# EAGLE schematic lonley rd front plate (EAGLE 8.5.2)
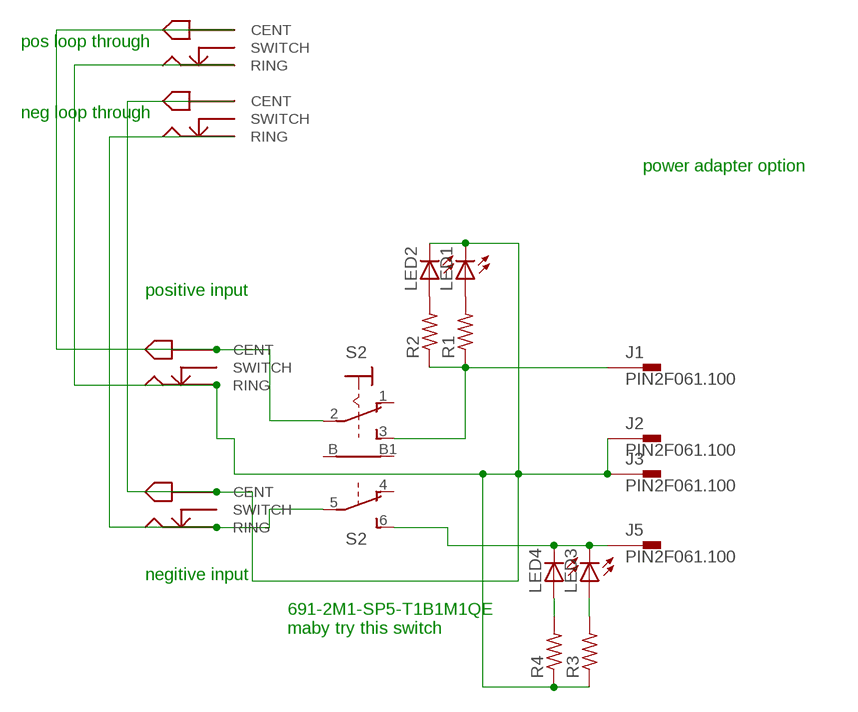
[diagram p0: schematic, sheet 1]

## Parts
J1  PIN2F061.100  [F061.100]
J2  PIN2F061.100  [F061.100]
J3  PIN2F061.100  [F061.100]
J5  PIN2F061.100  [F061.100]
LED1  LED3MM  [LED3MM]
LED2  LED3MM  [LED3MM]
LED3  LED3MM  [LED3MM]
LED4  LED3MM  [LED3MM]
R1  R-US_0309/V  [0309V]
R2  R-US_0309/V  [0309V]
R3  R-US_0309/V  [0309V]
R4  R-US_0309/V  [0309V]
S2  9070-2W  [9070-2W]
U$1  PJ-066A_DC_JACK  [PJ-066A_DC_JACK]
U$2  PJ-066A_DC_JACK  [PJ-066A_DC_JACK]
U$3  PJ-066A_DC_JACK  [PJ-066A_DC_JACK]
U$4  PJ-066A_DC_JACK  [PJ-066A_DC_JACK]

## Nets
N$1: LED2.A R2.2
N$2: J2.A1 J2.A2 J3.A1 J3.A2 LED1.K(C) LED2.K(C) R3.1 R4.1 U$1.RING U$2.CENT U$3.RING U$4.CENT
N$3: J1.A1 J1.A2 R1.1 R2.1 S2.3(1:S)
N$4: J5.A1 J5.A2 LED3.K(C) LED4.K(C)
N$5: S2.2(1:P) U$1.CENT U$3.CENT
N$6: U$2.RING U$4.RING
N$7: LED1.A R1.2
N$10: LED3.A R3.2
N$11: LED4.A R4.2
Unconnected: S2.1(1:O) S2.4(B:O) S2.5(B:P) S2.6(B:S) S2.B1(1:B1) S2.B(1:B) U$1.SWITCH U$2.SWITCH U$3.SWITCH U$4.SWITCH

## Notes on the sheet
- pos loop through
- neg loop through
- power adapter option
- positive input
- negitive input
- 691-2M1-SP5-T1B1M1QE
  maby try this switch

## Library data of the parts
J1-J3 J5 = con-faston:PIN2: Flachstecker Typ Tyco/Electronics/AMP TAB, FASTON Printed Circuit Board Tabs Source: http://www.buerklin.com, http://catalog.tycoelectronics.com; OC_FARNELL: unknown; OC_NEWARK: unknown
LED1-LED4 = adafruit:LED: LED OSRAM: - CHIPLED LG R971, LG N971, LY N971, LG Q971, LY Q971, LO R971, LY R971 LH N974, LH R974 LS Q976, LO Q976, LY Q976 LO Q996 - Hyper CHIPLED LW Q18S LB Q993, LB Q99A, LB R99A - SideLED LS A670, LO A670, LY A670, LG A670, LP A670 LB A673, LV A673, LT A673, LW A673 LH A674 LY A675 LS A676, LA A676, LO A676, LY A676, LW A676 LS A679, LY A679, LG A679 - Hyper Micro SIDELED® LS Y876, LA Y876, LO Y876, LY Y876 LT Y87S - SmartLED LW L88C, LW L88S LB L89C, LB L89S, LG L890 LS L89K, LO L89K, LY L89K LS L896, LA L896, LO L896, LY L896 - TOPLED LS T670, LO T670, LY T670, LG T670, LP T670 LSG T670, LSP T670, LSY T670, LOP T670, LYG T670 LG T671, LOG T671, LSG T671 LB T673, LV T673, LT T673, LW T673 LH T674 LS T676, LA T676, LO T676, LY T676, LB T676, LH T676, LSB T676, LW T676 LB T67C, LV T67C, LT T67C, LS T67K, LO T67K, LY T67K, LW E67C LS E67B, LA E67B, LO E67B, LY E67B, LB E67C, LV E67C, LT E67C LW T67C LS T679, LY T679, LG T679 LS T770, LO T770, LY T770, LG T770, LP T770 LB T773, LV T773, LT T773, LW T773 LH T774 LS E675, LA E675, LY E675, LS T675 LS T776, LA T776, LO T776, LY T776, LB T776 LHGB T686 LT T68C, LB T68C - Hyper Mini TOPLED® LB M676 - Mini TOPLED Santana® LG M470 LS M47K, LO M47K, LY M47K Source: http://www.osram.convergy.de/
R1-R4 = resistor:R-US_: RESISTOR, American symbol
S2 = switch:9070-2W: TOGGLE SWITCH Marquardt
U$1-U$4 = ROB LIB:PJ-066A_DC_JACK